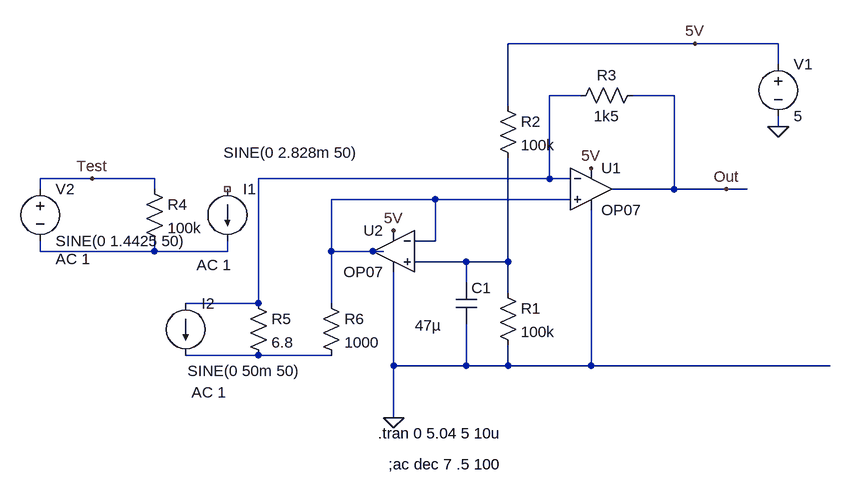
[diagram p0: schematic 50mA_CT_1Percent_Bleed_OP07.asc]
50mA_CT_1Percent_Bleed_OP07.asc, the LTspice schematic file:
Version 4
SHEET 1 880 680
WIRE 400 -192 112 -192
WIRE 528 -192 400 -192
WIRE 528 -160 528 -192
WIRE 224 -112 176 -112
WIRE 368 -112 304 -112
WIRE 112 -96 112 -192
WIRE 528 -64 528 -80
WIRE -528 16 -608 16
WIRE -432 16 -528 16
WIRE 176 16 176 -112
WIRE 176 16 -272 16
WIRE 208 16 176 16
WIRE -608 32 -608 16
WIRE -432 32 -432 16
WIRE 368 32 368 -112
WIRE 368 32 272 32
WIRE 448 32 368 32
WIRE 480 32 448 32
WIRE 0 48 -160 48
WIRE 208 48 0 48
WIRE 0 112 0 48
WIRE 0 112 -32 112
WIRE -608 128 -608 112
WIRE -432 128 -432 112
WIRE -432 128 -608 128
WIRE -320 128 -320 112
WIRE -320 128 -432 128
WIRE -160 128 -160 48
WIRE -96 128 -160 128
WIRE -80 128 -96 128
WIRE 48 144 -32 144
WIRE 112 144 112 -16
WIRE 112 144 48 144
WIRE 48 176 48 144
WIRE 112 192 112 144
WIRE -272 208 -272 16
WIRE -272 208 -384 208
WIRE -160 208 -160 128
WIRE -272 288 -384 288
WIRE -160 288 -272 288
WIRE -64 304 -64 160
WIRE 48 304 48 240
WIRE 48 304 -64 304
WIRE 112 304 112 272
WIRE 112 304 48 304
WIRE 240 304 240 64
WIRE 240 304 112 304
WIRE 608 304 240 304
WIRE -64 384 -64 304
FLAG -64 384 0
FLAG 448 32 Out
FLAG 528 -64 0
FLAG 400 -192 5V
FLAG 240 0 5V
FLAG -528 16 Test
FLAG -64 96 5V
SYMBOL Opamps\\OP07 240 -32 R0
SYMATTR InstName U1
SYMBOL current -320 32 R0
WINDOW 3 -6 -56 Left 2
WINDOW 123 -47 117 Left 2
WINDOW 39 0 0 Left 0
SYMATTR Value SINE(0 2.828m 50)
SYMATTR Value2 AC 1
SYMATTR InstName I1
SYMBOL res 96 176 R0
SYMATTR InstName R1
SYMATTR Value 100k
SYMBOL res 96 -112 R0
SYMATTR InstName R2
SYMATTR Value 100k
SYMBOL cap 32 176 R0
WINDOW 3 -63 66 Left 2
SYMATTR Value 47µ
SYMATTR InstName C1
SYMBOL res 320 -128 R90
WINDOW 0 0 56 VBottom 2
WINDOW 3 32 56 VTop 2
SYMATTR InstName R3
SYMATTR Value 1k5
SYMBOL voltage 528 -176 R0
WINDOW 123 0 0 Left 0
WINDOW 39 0 0 Left 0
SYMATTR InstName V1
SYMATTR Value 5
SYMBOL res -448 16 R0
SYMATTR InstName R4
SYMATTR Value 100k
SYMBOL voltage -608 16 R0
WINDOW 123 24 124 Left 2
WINDOW 39 0 0 Left 0
SYMATTR Value2 AC 1
SYMATTR InstName V2
SYMATTR Value SINE(0 1.4425 50)
SYMBOL Opamps\\OP07 -64 64 M0
SYMATTR InstName U2
SYMBOL current -384 208 R0
WINDOW 3 3 104 Left 2
WINDOW 123 9 137 Left 2
WINDOW 39 0 0 Left 0
SYMATTR Value SINE(0 50m 50)
SYMATTR Value2 AC 1
SYMATTR InstName I2
SYMBOL res -288 192 R0
SYMATTR InstName R5
SYMATTR Value 6.8
SYMBOL res -176 192 R0
SYMATTR InstName R6
SYMATTR Value 1000
TEXT -88 408 Left 2 !.tran 0 5.04 5 10u
TEXT -72 456 Left 2 !;ac dec 7 .5 100

The netlist it stands for:
* 50mA_CT_1Percent_Bleed_OP07.asc
XU1 N002 N001 5V 0 Out LT1001  ; OP07, pins In+ In- V+ V- OUT
I1 NC_01 N003 SINE(0 2.828m 50) AC 1
R1 N004 0 100k
R2 5V N004 100k
C1 N004 0 47µ
R3 Out N001 1k5
V1 5V 0 5
R4 Test N003 100k
V2 Test N003 SINE(0 1.4425 50) AC 1
XU2 N004 N002 5V 0 N002 LT1001  ; OP07, pins In+ In- V+ V- OUT
I2 N001 N005 SINE(0 50m 50) AC 1
R5 N001 N005 6.8
R6 N002 N005 1000
.tran 0 5.04 5 10u
;ac dec 7 .5 100
.lib LTC.lib
.backanno
.end